# EAGLE design Cameralink_Karmann (EAGLE 7.1.0)
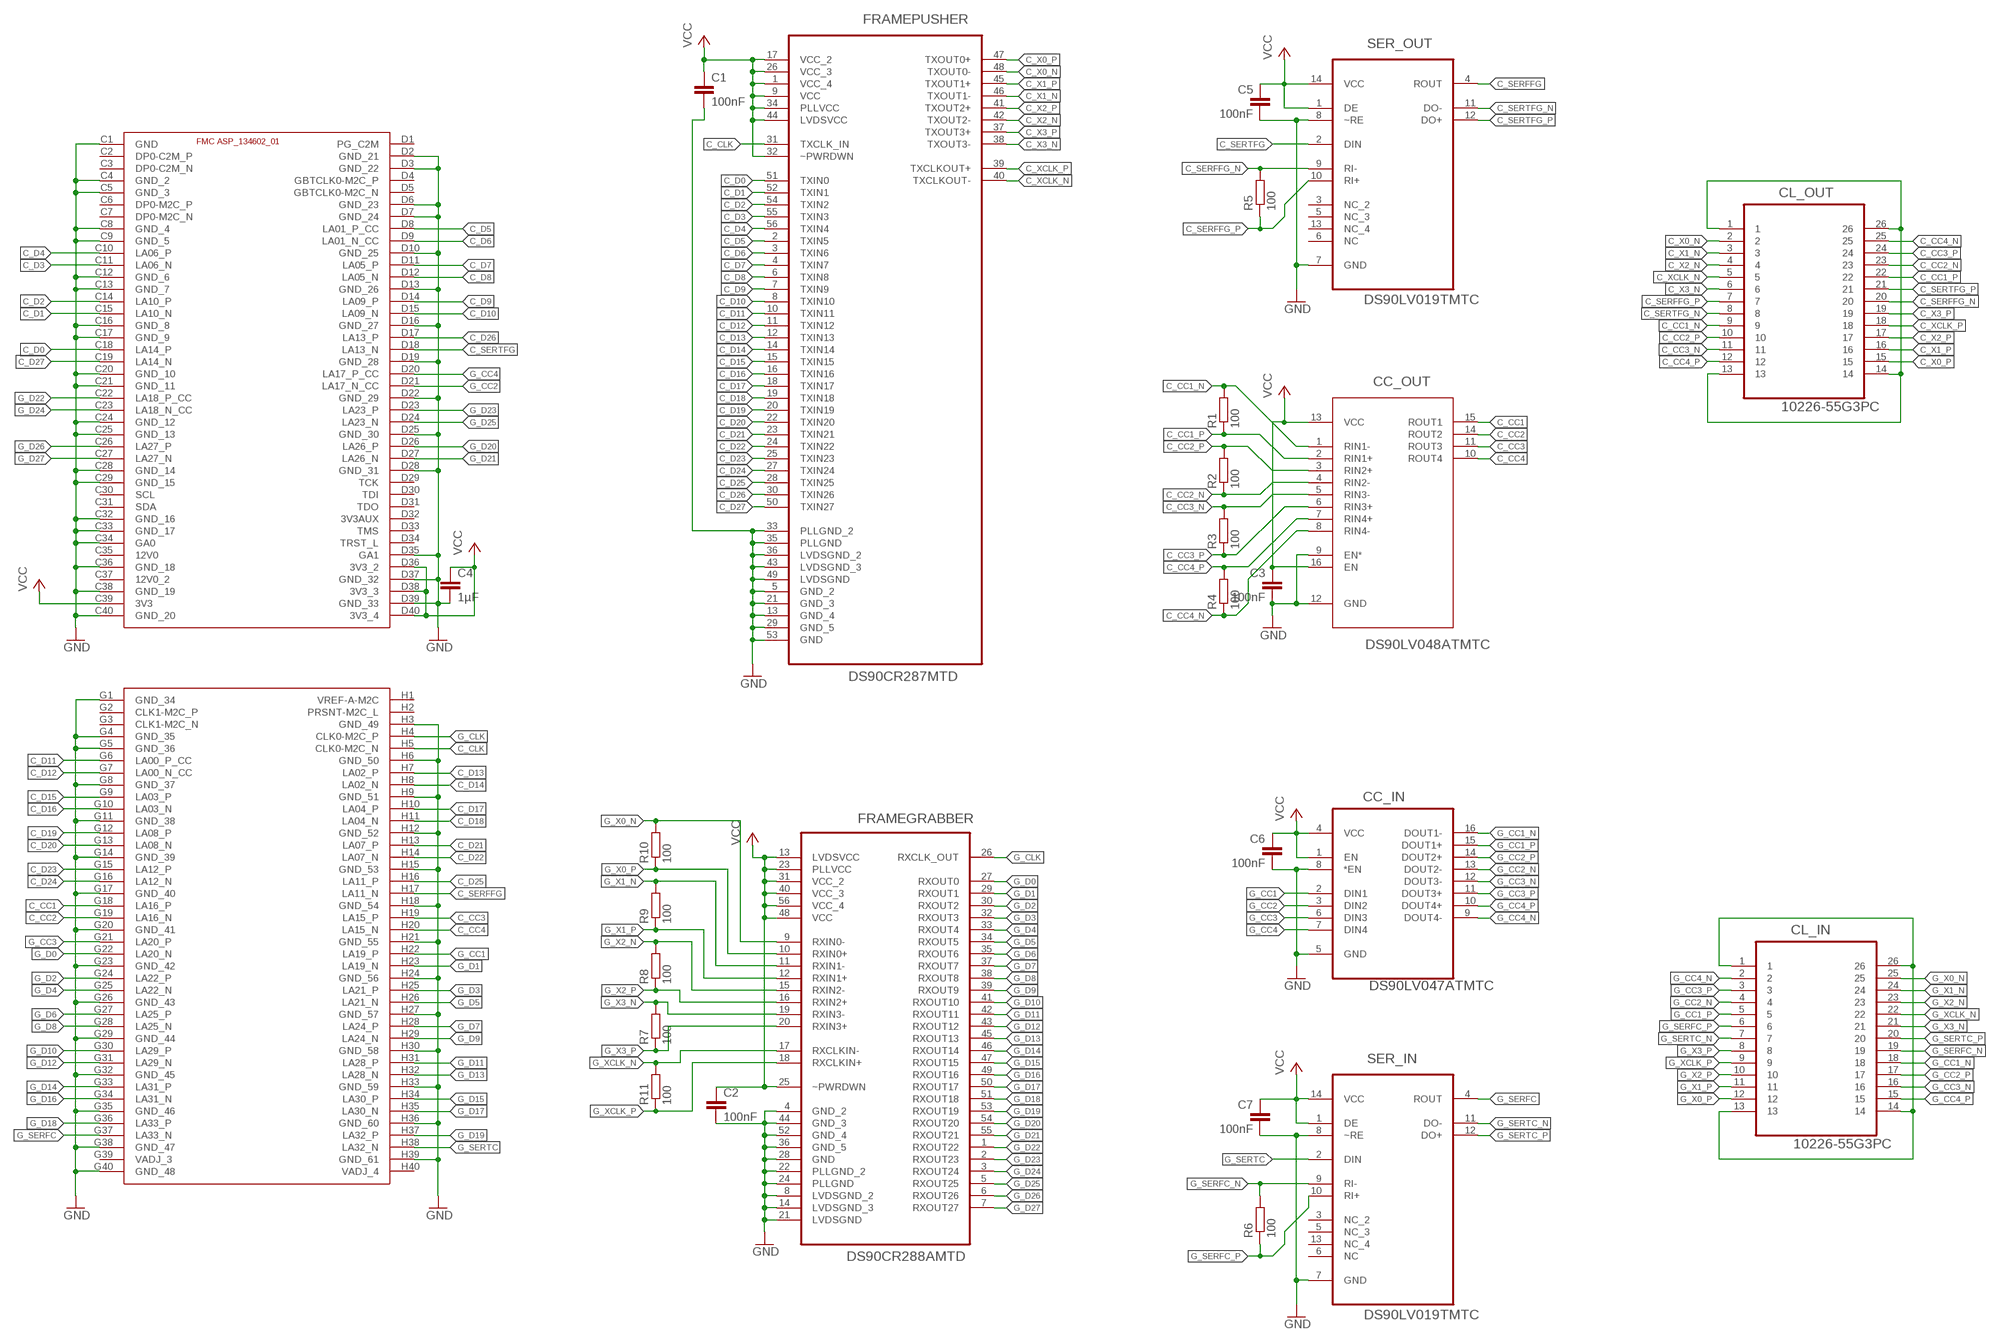
[diagram p0: schematic, sheet 1]

## Parts
C1  100nF  C-EUC1206  [C1206]
C2  100nF  C-EUC1206  [C1206]
C3  100nF  C-EUC1206  [C1206]
C4  1µF  C-EUC1206  [C1206]
C5  100nF  C-EUC1206  [C1206]
C6  100nF  C-EUC1206  [C1206]
C7  100nF  C-EUC1206  [C1206]
CC_IN  DS90LV047ATMTC  [SOP65P640X110-16N]
CC_OUT  DS90LV048ATMTC  [SOP65P640X110-16N]
CL_IN  10226-55G3PC  [3M_10226-55G3PC]
CL_OUT  10226-55G3PC  [3M_10226-55G3PC]
FRAMEGRABBER  DS90CR288AMTD  [SOP50P810X110-56N]
FRAMEPUSHER  DS90CR287MTD  [SOP50P810X110-56N]
R1  100  R-EU_R1206  [R1206]
R2  100  R-EU_R1206  [R1206]
R3  100  R-EU_R1206  [R1206]
R4  100  R-EU_R1206  [R1206]
R5  100  R-EU_R1206  [R1206]
R6  100  R-EU_R1206  [R1206]
R7  100  R-EU_R1206  [R1206]
R8  100  R-EU_R1206  [R1206]
R9  100  R-EU_R1206  [R1206]
R10  100  R-EU_R1206  [R1206]
R11  100  R-EU_R1206  [R1206]
SER_IN  DS90LV019TMTC  [SOP65P640X110-14N]
SER_OUT  DS90LV019TMTC  [SOP65P640X110-14N]
U$1  ASP_134602_01  [ASP_134602_01]

## Nets
C_CC1: CC_OUT.15(ROUT1) U$1.G18(LA16_P)
C_CC1_N: CC_OUT.1(RIN1-) CL_OUT.9 R1.2
C_CC1_P: CC_OUT.2(RIN1+) CL_OUT.22 R1.1
C_CC2: CC_OUT.14(ROUT2) U$1.G19(LA16_N)
C_CC2_N: CC_OUT.4(RIN2-) CL_OUT.23 R2.1
C_CC2_P: CC_OUT.3(RIN2+) CL_OUT.10 R2.2
C_CC3: CC_OUT.11(ROUT3) U$1.H19(LA15_P)
C_CC3_N: CC_OUT.5(RIN3-) CL_OUT.11 R3.2
C_CC3_P: CC_OUT.6(RIN3+) CL_OUT.24 R3.1
C_CC4: CC_OUT.10(ROUT4) U$1.H20(LA15_N)
C_CC4_N: CC_OUT.8(RIN4-) CL_OUT.25 R4.1
C_CC4_P: CC_OUT.7(RIN4+) CL_OUT.12 R4.2
C_CLK: FRAMEPUSHER.31(TXCLK_IN) U$1.H5(CLK0-M2C_N)
C_D0: FRAMEPUSHER.51(TXIN0) U$1.C18(LA14_P)
C_D1: FRAMEPUSHER.52(TXIN1) U$1.C15(LA10_N)
C_D2: FRAMEPUSHER.54(TXIN2) U$1.C14(LA10_P)
C_D3: FRAMEPUSHER.55(TXIN3) U$1.C11(LA06_N)
C_D4: FRAMEPUSHER.56(TXIN4) U$1.C10(LA06_P)
C_D5: FRAMEPUSHER.2(TXIN5) U$1.D8(LA01_P_CC)
C_D6: FRAMEPUSHER.3(TXIN6) U$1.D9(LA01_N_CC)
C_D7: FRAMEPUSHER.4(TXIN7) U$1.D11(LA05_P)
C_D8: FRAMEPUSHER.6(TXIN8) U$1.D12(LA05_N)
C_D9: FRAMEPUSHER.7(TXIN9) U$1.D14(LA09_P)
C_D10: FRAMEPUSHER.8(TXIN10) U$1.D15(LA09_N)
C_D11: FRAMEPUSHER.10(TXIN11) U$1.G6(LA00_P_CC)
C_D12: FRAMEPUSHER.11(TXIN12) U$1.G7(LA00_N_CC)
C_D13: FRAMEPUSHER.12(TXIN13) U$1.H7(LA02_P)
C_D14: FRAMEPUSHER.14(TXIN14) U$1.H8(LA02_N)
C_D15: FRAMEPUSHER.15(TXIN15) U$1.G9(LA03_P)
C_D16: FRAMEPUSHER.16(TXIN16) U$1.G10(LA03_N)
C_D17: FRAMEPUSHER.18(TXIN17) U$1.H10(LA04_P)
C_D18: FRAMEPUSHER.19(TXIN18) U$1.H11(LA04_N)
C_D19: FRAMEPUSHER.20(TXIN19) U$1.G12(LA08_P)
C_D20: FRAMEPUSHER.22(TXIN20) U$1.G13(LA08_N)
C_D21: FRAMEPUSHER.23(TXIN21) U$1.H13(LA07_P)
C_D22: FRAMEPUSHER.24(TXIN22) U$1.H14(LA07_N)
C_D23: FRAMEPUSHER.25(TXIN23) U$1.G15(LA12_P)
C_D24: FRAMEPUSHER.27(TXIN24) U$1.G16(LA12_N)
C_D25: FRAMEPUSHER.28(TXIN25) U$1.H16(LA11_P)
C_D26: FRAMEPUSHER.30(TXIN26) U$1.D17(LA13_P)
C_D27: FRAMEPUSHER.50(TXIN27) U$1.C19(LA14_N)
C_SERFFG: SER_OUT.4(ROUT) U$1.H17(LA11_N)
C_SERFFG_N: CL_OUT.20 R5.2 SER_OUT.9(RI-)
C_SERFFG_P: CL_OUT.7 R5.1 SER_OUT.10(RI+)
C_SERTFG: SER_OUT.2(DIN) U$1.D18(LA13_N)
C_SERTFG_N: CL_OUT.8 SER_OUT.11(DO-)
C_SERTFG_P: CL_OUT.21 SER_OUT.12(DO+)
C_SHIELD: CL_OUT.1 CL_OUT.13 CL_OUT.14 CL_OUT.26
C_X0_N: CL_OUT.2 FRAMEPUSHER.48(TXOUT0-)
C_X0_P: CL_OUT.15 FRAMEPUSHER.47(TXOUT0+)
C_X1_N: CL_OUT.3 FRAMEPUSHER.46(TXOUT1-)
C_X1_P: CL_OUT.16 FRAMEPUSHER.45(TXOUT1+)
C_X2_N: CL_OUT.4 FRAMEPUSHER.42(TXOUT2-)
C_X2_P: CL_OUT.17 FRAMEPUSHER.41(TXOUT2+)
C_X3_N: CL_OUT.6 FRAMEPUSHER.38(TXOUT3-)
C_X3_P: CL_OUT.19 FRAMEPUSHER.37(TXOUT3+)
C_XCLK_N: CL_OUT.5 FRAMEPUSHER.40(TXCLKOUT-)
C_XCLK_P: CL_OUT.18 FRAMEPUSHER.39(TXCLKOUT+)
G_CC1: CC_IN.2(DIN1) U$1.H22(LA19_P)
G_CC1_N: CC_IN.16(DOUT1-) CL_IN.18
G_CC1_P: CC_IN.15(DOUT1+) CL_IN.5
G_CC2: CC_IN.3(DIN2) U$1.D21(LA17_N_CC)
G_CC2_N: CC_IN.13(DOUT2-) CL_IN.4
G_CC2_P: CC_IN.14(DOUT2+) CL_IN.17
G_CC3: CC_IN.6(DIN3) U$1.G21(LA20_P)
G_CC3_N: CC_IN.12(DOUT3-) CL_IN.16
G_CC3_P: CC_IN.11(DOUT3+) CL_IN.3
G_CC4: CC_IN.7(DIN4) U$1.D20(LA17_P_CC)
G_CC4_N: CC_IN.9(DOUT4-) CL_IN.2
G_CC4_P: CC_IN.10(DOUT4+) CL_IN.15
G_CLK: FRAMEGRABBER.26(RXCLK_OUT) U$1.H4(CLK0-M2C_P)
G_D0: FRAMEGRABBER.27(RXOUT0) U$1.G22(LA20_N)
G_D1: FRAMEGRABBER.29(RXOUT1) U$1.H23(LA19_N)
G_D2: FRAMEGRABBER.30(RXOUT2) U$1.G24(LA22_P)
G_D3: FRAMEGRABBER.32(RXOUT3) U$1.H25(LA21_P)
G_D4: FRAMEGRABBER.33(RXOUT4) U$1.G25(LA22_N)
G_D5: FRAMEGRABBER.34(RXOUT5) U$1.H26(LA21_N)
G_D6: FRAMEGRABBER.35(RXOUT6) U$1.G27(LA25_P)
G_D7: FRAMEGRABBER.37(RXOUT7) U$1.H28(LA24_P)
G_D8: FRAMEGRABBER.38(RXOUT8) U$1.G28(LA25_N)
G_D9: FRAMEGRABBER.39(RXOUT9) U$1.H29(LA24_N)
G_D10: FRAMEGRABBER.41(RXOUT10) U$1.G30(LA29_P)
G_D11: FRAMEGRABBER.42(RXOUT11) U$1.H31(LA28_P)
G_D12: FRAMEGRABBER.43(RXOUT12) U$1.G31(LA29_N)
G_D13: FRAMEGRABBER.45(RXOUT13) U$1.H32(LA28_N)
G_D14: FRAMEGRABBER.46(RXOUT14) U$1.G33(LA31_P)
G_D15: FRAMEGRABBER.47(RXOUT15) U$1.H34(LA30_P)
G_D16: FRAMEGRABBER.49(RXOUT16) U$1.G34(LA31_N)
G_D17: FRAMEGRABBER.50(RXOUT17) U$1.H35(LA30_N)
G_D18: FRAMEGRABBER.51(RXOUT18) U$1.G36(LA33_P)
G_D19: FRAMEGRABBER.53(RXOUT19) U$1.H37(LA32_P)
G_D20: FRAMEGRABBER.54(RXOUT20) U$1.D26(LA26_P)
G_D21: FRAMEGRABBER.55(RXOUT21) U$1.D27(LA26_N)
G_D22: FRAMEGRABBER.1(RXOUT22) U$1.C22(LA18_P_CC)
G_D23: FRAMEGRABBER.2(RXOUT23) U$1.D23(LA23_P)
G_D24: FRAMEGRABBER.3(RXOUT24) U$1.C23(LA18_N_CC)
G_D25: FRAMEGRABBER.5(RXOUT25) U$1.D24(LA23_N)
G_D26: FRAMEGRABBER.6(RXOUT26) U$1.C26(LA27_P)
G_D27: FRAMEGRABBER.7(RXOUT27) U$1.C27(LA27_N)
G_SERFC: SER_IN.4(ROUT) U$1.G37(LA33_N)
G_SERFC_N: CL_IN.19 R6.2 SER_IN.9(RI-)
G_SERFC_P: CL_IN.6 R6.1 SER_IN.10(RI+)
G_SERTC: SER_IN.2(DIN) U$1.H38(LA32_N)
G_SERTC_N: CL_IN.7 SER_IN.11(DO-)
G_SERTC_P: CL_IN.20 SER_IN.12(DO+)
G_SHIELD: CL_IN.1 CL_IN.13 CL_IN.14 CL_IN.26
G_X0_N: CL_IN.25 FRAMEGRABBER.9(RXIN0-) R10.2
G_X0_P: CL_IN.12 FRAMEGRABBER.10(RXIN0+) R10.1
G_X1_N: CL_IN.24 FRAMEGRABBER.11(RXIN1-) R9.2
G_X1_P: CL_IN.11 FRAMEGRABBER.12(RXIN1+) R9.1
G_X2_N: CL_IN.23 FRAMEGRABBER.15(RXIN2-) R8.2
G_X2_P: CL_IN.10 FRAMEGRABBER.16(RXIN2+) R8.1
G_X3_N: CL_IN.21 FRAMEGRABBER.19(RXIN3-) R7.2
G_X3_P: CL_IN.8 FRAMEGRABBER.20(RXIN3+) R7.1
G_XCLK_N: CL_IN.22 FRAMEGRABBER.17(RXCLKIN-) R11.2
G_XCLK_P: CL_IN.9 FRAMEGRABBER.18(RXCLKIN+) R11.1
GND: C1.2 C2.2 C3.2 C4.2 C5.2 C6.2 C7.2 CC_IN.5(GND) CC_IN.8(*EN) CC_OUT.9(EN*) CC_OUT.12(GND) FRAMEGRABBER.4(GND_2) FRAMEGRABBER.8(LVDSGND_2) FRAMEGRABBER.14(LVDSGND_3) FRAMEGRABBER.21(LVDSGND) FRAMEGRABBER.22(PLLGND_2) FRAMEGRABBER.24(PLLGND) FRAMEGRABBER.28(GND) FRAMEGRABBER.36(GND_5) FRAMEGRABBER.44(GND_3) FRAMEGRABBER.52(GND_4) FRAMEPUSHER.5(GND_2) FRAMEPUSHER.13(GND_4) FRAMEPUSHER.21(GND_3) FRAMEPUSHER.29(GND_5) FRAMEPUSHER.33(PLLGND_2) FRAMEPUSHER.35(PLLGND) FRAMEPUSHER.36(LVDSGND_2) FRAMEPUSHER.43(LVDSGND_3) FRAMEPUSHER.49(LVDSGND) FRAMEPUSHER.53(GND) SER_IN.7(GND) SER_IN.8(~RE) SER_OUT.7(GND) SER_OUT.8(~RE) U$1.C1(GND) U$1.C4(GND_2) U$1.C5(GND_3) U$1.C8(GND_4) U$1.C9(GND_5) U$1.C12(GND_6) U$1.C13(GND_7) U$1.C16(GND_8) U$1.C17(GND_9) U$1.C20(GND_10) U$1.C21(GND_11) U$1.C24(GND_12) U$1.C25(GND_13) U$1.C28(GND_14) U$1.C29(GND_15) U$1.C32(GND_16) U$1.C33(GND_17) U$1.C34(GA0) U$1.C36(GND_18) U$1.C38(GND_19) U$1.C40(GND_20) U$1.D2(GND_21) U$1.D3(GND_22) U$1.D6(GND_23) U$1.D7(GND_24) U$1.D10(GND_25) U$1.D13(GND_26) U$1.D16(GND_27) U$1.D19(GND_28) U$1.D22(GND_29) U$1.D25(GND_30) U$1.D28(GND_31) U$1.D35(GA1) U$1.D37(GND_32) U$1.D39(GND_33) U$1.G1(GND_34) U$1.G4(GND_35) U$1.G5(GND_36) U$1.G8(GND_37) U$1.G11(GND_38) U$1.G14(GND_39) U$1.G17(GND_40) U$1.G20(GND_41) U$1.G23(GND_42) U$1.G26(GND_43) U$1.G29(GND_44) U$1.G32(GND_45) U$1.G35(GND_46) U$1.G38(GND_47) U$1.G40(GND_48) U$1.H3(GND_49) U$1.H6(GND_50) U$1.H9(GND_51) U$1.H12(GND_52) U$1.H15(GND_53) U$1.H18(GND_54) U$1.H21(GND_55) U$1.H24(GND_56) U$1.H27(GND_57) U$1.H30(GND_58) U$1.H33(GND_59) U$1.H36(GND_60) U$1.H39(GND_61)
VCC: C1.1 C2.1 C3.1 C4.1 C5.1 C6.1 C7.1 CC_IN.1(EN) CC_IN.4(VCC) CC_OUT.13(VCC) CC_OUT.16(EN) FRAMEGRABBER.13(LVDSVCC) FRAMEGRABBER.23(PLLVCC) FRAMEGRABBER.25(~PWRDWN) FRAMEGRABBER.31(VCC_2) FRAMEGRABBER.40(VCC_3) FRAMEGRABBER.48(VCC) FRAMEGRABBER.56(VCC_4) FRAMEPUSHER.1(VCC_4) FRAMEPUSHER.9(VCC) FRAMEPUSHER.17(VCC_2) FRAMEPUSHER.26(VCC_3) FRAMEPUSHER.32(~PWRDWN) FRAMEPUSHER.34(PLLVCC) FRAMEPUSHER.44(LVDSVCC) SER_IN.1(DE) SER_IN.14(VCC) SER_OUT.1(DE) SER_OUT.14(VCC) U$1.C39(3V3) U$1.D36(3V3_2) U$1.D38(3V3_3) U$1.D40(3V3_4)
Unconnected: SER_IN.3(NC_2) SER_IN.5(NC_3) SER_IN.6(NC) SER_IN.13(NC_4) SER_OUT.3(NC_2) SER_OUT.5(NC_3) SER_OUT.6(NC) SER_OUT.13(NC_4) U$1.C2(DP0-C2M_P) U$1.C3(DP0-C2M_N) U$1.C6(DP0-M2C_P) U$1.C7(DP0-M2C_N) U$1.C30(SCL) U$1.C31(SDA) U$1.C35(12V0) U$1.C37(12V0_2) U$1.D1(PG_C2M) U$1.D4(GBTCLK0-M2C_P) U$1.D5(GBTCLK0-M2C_N) U$1.D29(TCK) U$1.D30(TDI) U$1.D31(TDO) U$1.D32(3V3AUX) U$1.D33(TMS) U$1.D34(TRST_L) U$1.G2(CLK1-M2C_P) U$1.G3(CLK1-M2C_N) U$1.G39(VADJ_3) U$1.H1(VREF-A-M2C) U$1.H2(PRSNT-M2C_L) U$1.H40(VADJ_4)

## Library data of the parts
C1-C7 = rcl:C-EU: CAPACITOR, European symbol
CC_IN = Cameralink:DS90LV047ATMTC: CMOS Differential Line Driver; MPN: DS90LV047ATMTC; OC_FARNELL: 9778659; OC_NEWARK: 41K2094; PACKAGE: 16-TSSOP; SUPPLIER: National Semiconductor
CC_OUT = Cameralink:DS90LV048ATMTC: LVDS Quad CMOS Differential Line Receiver; MPN: DS90LV048ATMTC; OC_FARNELL: 9778667; OC_NEWARK: 74C3618; PACKAGE: TSSOP-16; SUPPLIER: National Semiconductor
CL_IN CL_OUT = Cameralink:10226-55G3PC: CONN MDR RCPT 26POS R/A M2.5; MPN: 10226-55G3PC; OC_FARNELL: 1463015; OC_NEWARK: 93K6331; PACKAGE: MDR RCPT 26POS R/A M2.; SUPPLIER: 3M
FRAMEGRABBER = Cameralink:DS90CR288AMTD: Edge Data Strobe; MPN: DS90CR288AMTD; OC_FARNELL: 1685539; OC_NEWARK: 41K2011; PACKAGE: SOP-56; SUPPLIER: NationalSemiconductor
FRAMEPUSHER = Cameralink:DS90CR287MTD: Edge Data Strobe; MPN: DS90CR287MTD; OC_FARNELL: 1215184; OC_NEWARK: 01M7382; PACKAGE: SSOP-56; SUPPLIER: NationalSemiconductor
R1-R11 = rcl:R-EU_: RESISTOR, European symbol
SER_IN SER_OUT = Cameralink:DS90LV019TMTC: LVDS Driver/Receiver; MPN: DS90LV019TMTC; OC_FARNELL: 1286826; OC_NEWARK: 38K1016; PACKAGE: SOP-14; SUPPLIER: NationalSemiconductor
U$1 = FMC_Stecker:ASP_134602_01

## Board
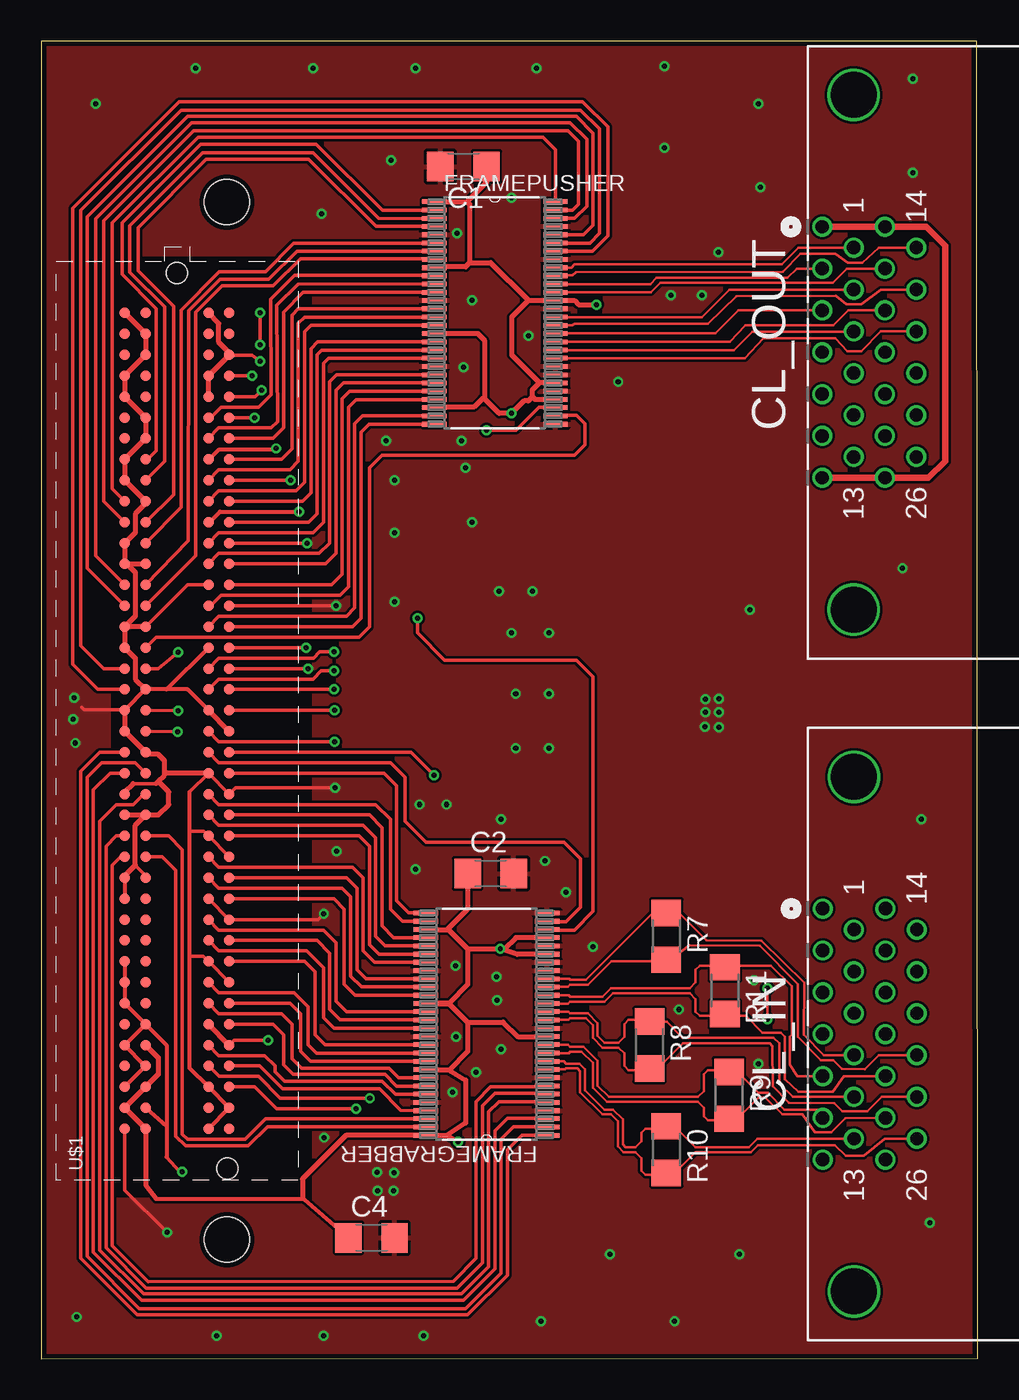
[diagram p1: board, top side]
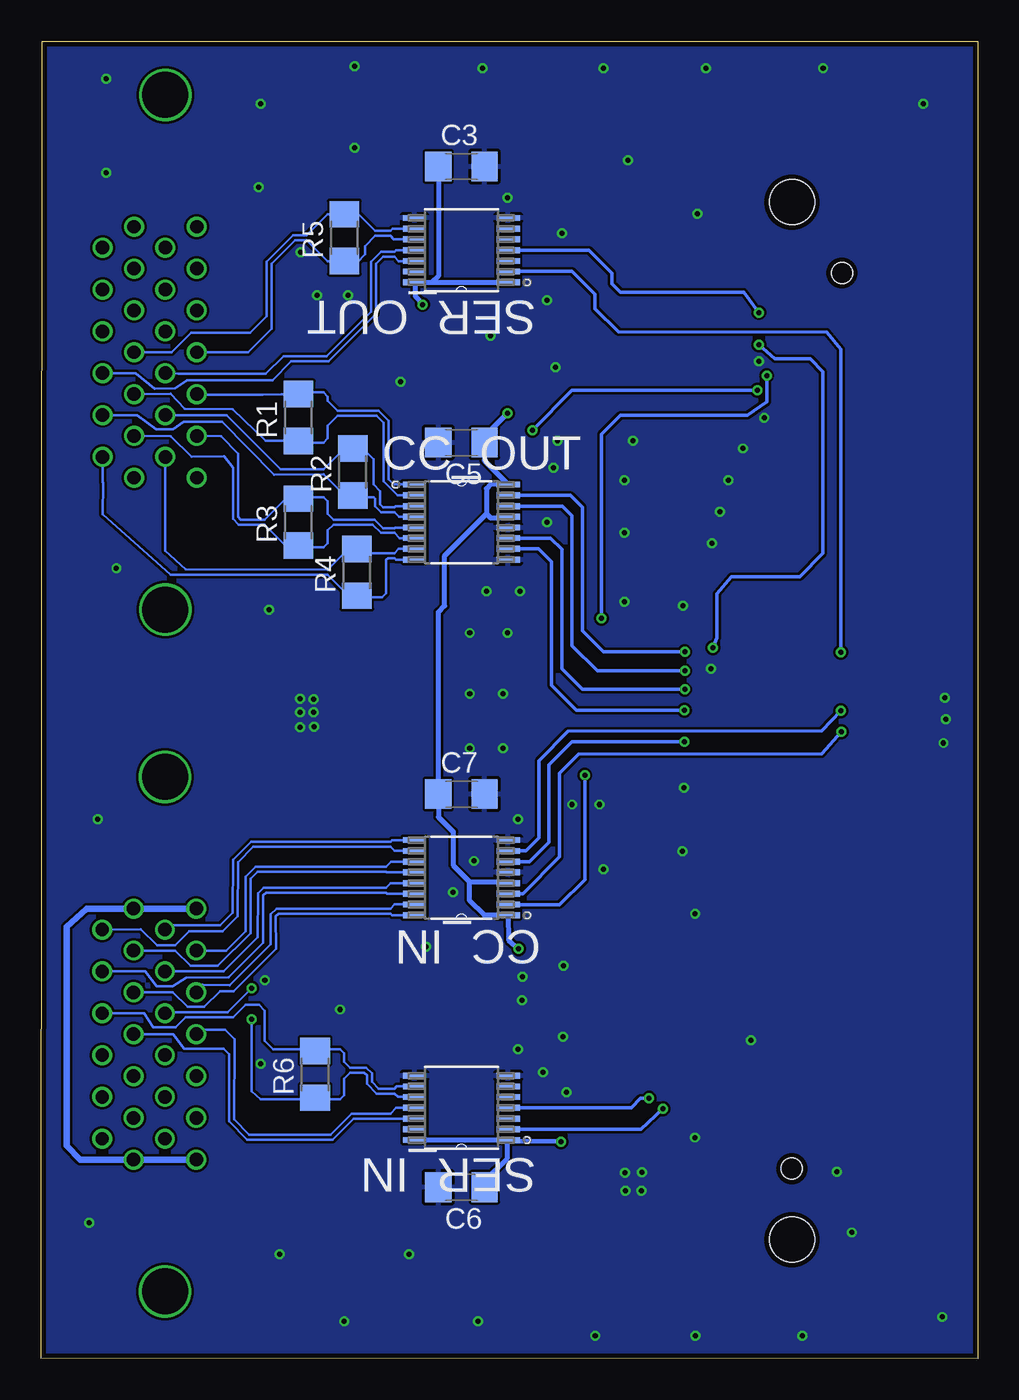
[diagram p2: board, bottom side, seen from below]

Size 56.9 x 80 mm. Coordinates in mm from the lower left corner, seen from the top.
Outline: 0,0 56.9,0.03 56.82,80 0,80 0,0
Copper layers (1*16): Top 0.035mm / dielectric 1.5mm / Bottom 0.035mm
Design rules "PCB-POOL_Standard[1]": minimum track width 0.15mm, minimum drill 0.3mm, track to track 0.15mm, track to pad 0.15mm, pad to pad 0.15mm, via to via 0.15mm, smd to smd 0.15mm, copper to edge 0.3mm, drill to drill 0.2mm, minimum pad ring 0.2mm, minimum via ring 0.15mm, stop-mask expansion 0.075mm, vias tented up to drill 0mil, thermal gap 0.2mm
tRestrict: area 4.3,9.8 to 16.4,66.9

### Footprints (pad centres in the part's own frame; a part is rotated, then mirrored left to right if it is on the bottom)
C1206 = smd 1.6 x 1.8: 1 -1.4,0; 2 1.4,0
SOP65P640X110-16N = smd 1.422 x 0.356: 1 -2.845,2.286; 2 -2.845,1.626; 3 -2.845,0.965; 4 -2.845,0.33; 5 -2.845,-0.33; 6 -2.845,-0.965; 7 -2.845,-1.626; 8 -2.845,-2.286; 9 2.845,-2.286; 10 2.845,-1.626; 11 2.845,-0.965; 12 2.845,-0.33; 13 2.845,0.33; 14 2.845,0.965; 15 2.845,1.626; 16 2.845,2.286
3M_10226-55G3PC = drill 0.813: 1 15.24,5.715; 2 13.97,3.81; 3 12.7,5.715; 4 11.43,3.81; 5 10.16,5.715; 6 8.89,3.81; 7 7.62,5.715; 8 6.35,3.81; 9 5.08,5.715; 10 3.81,3.81; 11 2.54,5.715; 12 1.27,3.81; 13 0,5.715; 14 15.24,1.905; 15 13.97,0; 16 12.7,1.905; 17 11.43,0; 18 10.16,1.905; 19 8.89,0; 20 7.62,1.905; 21 6.35,0; 22 5.08,1.905; 23 3.81,0; 24 2.54,1.905; 25 1.27,0; 26 0,1.905 | drill 2.794: 27 -8.001,3.81; 28 23.241,3.81
SOP50P810X110-56N = smd 1.473 x 0.279: 1 -3.683,6.756; 2 -3.683,6.248; 3 -3.683,5.74; 4 -3.683,5.258; 5 -3.683,4.75; 6 -3.683,4.242; 7 -3.683,3.759; 8 -3.683,3.251; 9 -3.683,2.743; 10 -3.683,2.261; 11 -3.683,1.753; 12 -3.683,1.245; 13 -3.683,0.762; 14 -3.683,0.254; 15 -3.683,-0.254; 16 -3.683,-0.762; 17 -3.683,-1.245; 18 -3.683,-1.753; 19 -3.683,-2.261; 20 -3.683,-2.743; 21 -3.683,-3.251; 22 -3.683,-3.759; 23 -3.683,-4.242; 24 -3.683,-4.75; 25 -3.683,-5.258; 26 -3.683,-5.74; 27 -3.683,-6.248; 28 -3.683,-6.756; 29 3.683,-6.756; 30 3.683,-6.248; 31 3.683,-5.74; 32 3.683,-5.258; 33 3.683,-4.75; 34 3.683,-4.242; 35 3.683,-3.759; 36 3.683,-3.251; 37 3.683,-2.743; 38 3.683,-2.261; 39 3.683,-1.753; 40 3.683,-1.245; 41 3.683,-0.762; 42 3.683,-0.254; 43 3.683,0.254; 44 3.683,0.762; 45 3.683,1.245; 46 3.683,1.753; 47 3.683,2.261; 48 3.683,2.743; 49 3.683,3.251; 50 3.683,3.759; 51 3.683,4.242; 52 3.683,4.75; 53 3.683,5.258; 54 3.683,5.74; 55 3.683,6.248; 56 3.683,6.756
R1206 = smd 1.6 x 1.803: 1 -1.422,0; 2 1.422,0
SOP65P640X110-14N = smd 1.422 x 0.356: 1 -2.845,1.956; 2 -2.845,1.295; 3 -2.845,0.66; 4 -2.845,0; 5 -2.845,-0.66; 6 -2.845,-1.295; 7 -2.845,-1.956; 8 2.845,-1.956; 9 2.845,-1.295; 10 2.845,-0.66; 11 2.845,0; 12 2.845,0.66; 13 2.845,1.295; 14 2.845,1.956
ASP_134602_01 = smd 0.635 x 0.635: C1 49.53,-2.54; C2 48.26,-2.54; C3 46.99,-2.54; C4 45.72,-2.54; C5 44.45,-2.54; C6 43.18,-2.54; C7 41.91,-2.54; C8 40.64,-2.54; C9 39.37,-2.54; C10 38.1,-2.54; C11 36.83,-2.54; C12 35.56,-2.54; C13 34.29,-2.54; C14 33.02,-2.54; C15 31.75,-2.54; C16 30.48,-2.54; C17 29.21,-2.54; C18 27.94,-2.54; C19 26.67,-2.54; C20 25.4,-2.54; C21 24.13,-2.54; C22 22.86,-2.54; C23 21.59,-2.54; C24 20.32,-2.54; C25 19.05,-2.54; C26 17.78,-2.54; C27 16.51,-2.54; C28 15.24,-2.54; C29 13.97,-2.54; C30 12.7,-2.54; C31 11.43,-2.54; C32 10.16,-2.54; C33 8.89,-2.54; C34 7.62,-2.54; C35 6.35,-2.54; C36 5.08,-2.54; C37 3.81,-2.54; C38 2.54,-2.54; C39 1.27,-2.54; C40 0,-2.54; D1 49.53,-3.81; D2 48.26,-3.81; D3 46.99,-3.81; D4 45.72,-3.81; D5 44.45,-3.81; D6 43.18,-3.81; D7 41.91,-3.81; D8 40.64,-3.81; D9 39.37,-3.81; D10 38.1,-3.81; D11 36.83,-3.81; D12 35.56,-3.81; D13 34.29,-3.81; D14 33.02,-3.81; D15 31.75,-3.81; D16 30.48,-3.81; D17 29.21,-3.81; D18 27.94,-3.81; D19 26.67,-3.81; D20 25.4,-3.81; D21 24.13,-3.81; D22 22.86,-3.81; D23 21.59,-3.81; D24 20.32,-3.81; D25 19.05,-3.81; D26 17.78,-3.81; D27 16.51,-3.81; D28 15.24,-3.81; D29 13.97,-3.81; D30 12.7,-3.81; D31 11.43,-3.81; D32 10.16,-3.81; D33 8.89,-3.81; D34 7.62,-3.81; D35 6.35,-3.81; D36 5.08,-3.81; D37 3.81,-3.81; D38 2.54,-3.81; D39 1.27,-3.81; D40 0,-3.81; G1 49.53,-7.62; G2 48.26,-7.62; G3 46.99,-7.62; G4 45.72,-7.62; G5 44.45,-7.62; G6 43.18,-7.62; G7 41.91,-7.62; G8 40.64,-7.62; G9 39.37,-7.62; G10 38.1,-7.62; G11 36.83,-7.62; G12 35.56,-7.62; G13 34.29,-7.62; G14 33.02,-7.62; G15 31.75,-7.62; G16 30.48,-7.62; G17 29.21,-7.62; G18 27.94,-7.62; G19 26.67,-7.62; G20 25.4,-7.62; G21 24.13,-7.62; G22 22.86,-7.62; G23 21.59,-7.62; G24 20.32,-7.62; G25 19.05,-7.62; G26 17.78,-7.62; G27 16.51,-7.62; G28 15.24,-7.62; G29 13.97,-7.62; G30 12.7,-7.62; G31 11.43,-7.62; G32 10.16,-7.62; G33 8.89,-7.62; G34 7.62,-7.62; G35 6.35,-7.62; G36 5.08,-7.62; G37 3.81,-7.62; G38 2.54,-7.62; G39 1.27,-7.62; G40 0,-7.62; H1 49.53,-8.89; H2 48.26,-8.89; H3 46.99,-8.89; H4 45.72,-8.89; H5 44.45,-8.89; H6 43.18,-8.89; H7 41.91,-8.89; H8 40.64,-8.89; H9 39.37,-8.89; H10 38.1,-8.89; H11 36.83,-8.89; H12 35.56,-8.89; H13 34.29,-8.89; H14 33.02,-8.89; H15 31.75,-8.89; H16 30.48,-8.89; H17 29.21,-8.89; H18 27.94,-8.89; H19 26.67,-8.89; H20 25.4,-8.89; H21 24.13,-8.89; H22 22.86,-8.89; H23 21.59,-8.89; H24 20.32,-8.89; H25 19.05,-8.89; H26 17.78,-8.89; H27 16.51,-8.89; H28 15.24,-8.89; H29 13.97,-8.89; H30 12.7,-8.89; H31 11.43,-8.89; H32 10.16,-8.89; H33 8.89,-8.89; H34 7.62,-8.89; H35 6.35,-8.89; H36 5.08,-8.89; H37 3.81,-8.89; H38 2.54,-8.89; H39 1.27,-8.89; H40 0,-8.89 | hole 1.27: -2.426,-8.763; 51.956,-5.715 | hole 2.731: -6.731,-8.745; 56.261,-8.745

### Placement (x,y rotation side)
C1  25.65,72.39 180 top
C2  27.3,29.46 0 top
C3  31.37,72.39 0 bottom
C4  20.07,7.34 0 top
C5  31.37,55.63 180 bottom
C6  31.37,10.41 180 bottom
C7  31.37,34.29 0 bottom
CC_IN  31.37,29.21 180 bottom
CC_OUT  31.37,50.8 0 bottom
CL_IN  53.19,12.09 90 top
CL_OUT  53.16,53.49 90 top
FRAMEGRABBER  27.05,20.32 180 top
FRAMEPUSHER  27.56,63.5 0 top
R1  41.27,57.15 90 bottom
R2  37.97,53.85 90 bottom
R3  41.27,50.8 90 bottom
R4  37.72,47.75 90 bottom
R5  38.48,68.07 90 bottom
R6  40.26,17.27 90 bottom
R7  37.97,25.65 270 top
R8  36.96,19.05 270 top
R9  41.78,16 270 top
R10  37.97,12.7 270 top
R11  41.53,22.35 270 top
SER_IN  31.37,15.24 180 bottom
SER_OUT  31.37,67.31 180 bottom
U$1  2.54,13.97 90 top

### Tracks (layer width: path | path; a pad name or v marks a point on that pad's centre or on a via)
C_CC1  (via drill 0.3)
  Top 0.203: U$1.G18 10.79,42.55 16.54,42.55 16.92,42.93 v17.8,42.93
  Bottom 0.203: CC_OUT.15 24.74,52.43 24,51.69 24,44.2 22.73,42.93 v17.8,42.93
C_CC1_N
  Bottom 0.15: CC_OUT.1 35.48,53.09 35.79,53.4 35.79,56.96 36.39,57.55 38.88,57.55 39.5,58.17 39.5,58.42 39.75,58.67 41.17,58.67 R1.2 42.29,58.57 43.43,58.55 46.97,58.55 CL_OUT.9
C_CC1_P
  Bottom 0.15: CC_OUT.2 35.24,52.43 36.09,53.28 36.09,56.83 36.51,57.25 38.88,57.25 39.5,56.64 39.5,55.88 39.75,55.63 41.17,55.63 R1.1 43.26,55.73 45.26,57.66 48.18,57.68 49.02,58.6 CL_OUT.22
C_CC2  (via drill 0.3)
  Top 0.203: U$1.G19 10.79,41.27 16.51,41.27 17.02,41.78 v17.8,41.78
  Bottom 0.203: CC_OUT.14 25.22,51.77 24.64,51.18 24.64,43.31 23.11,41.78 v17.8,41.78
C_CC2_N
  Bottom 0.15: CC_OUT.4 35.15,51.13 35.43,51.41 36.26,51.41 36.6,51.75 36.6,52.22 36.7,52.32 37.87,52.32 R2.1 38.48,52.43 39.75,53.7 42.73,53.67 45.91,56.9 48.23,56.9 48.87,56.44 49.91,56.44 51.05,57.28 CL_OUT.23
C_CC2_P
  Bottom 0.15: CC_OUT.3 35.38,51.77 35.43,51.71 36.13,51.71 36.3,51.88 36.3,52.68 36.7,53.09 36.7,54.61 37.21,55.12 37.82,55.12 R2.2 38.48,55.27 39.75,54 42.36,54 45.63,57.3 48.89,57.3 CL_OUT.10
C_CC3  (via drill 0.3)
  Top 0.203: v17.8,40.64 U$1.H19
  Bottom 0.203: CC_OUT.11 25.96,49.84 25.27,49.15 25.27,41.91 24,40.64 v17.8,40.64
C_CC3_N
  Bottom 0.15: CC_OUT.5 35.41,50.47 35.43,50.44 36.13,50.44 36.64,50.95 39.14,50.95 39.5,51.31 39.5,52.07 39.75,52.32 41.17,52.32 R3.2 42.03,52.22 43.31,50.95 44.77,50.95 44.94,51.12 44.94,54.95 45.97,56.01 CL_OUT.11
C_CC3_P
  Bottom 0.15: CC_OUT.6 35.13,49.84 35.43,50.14 36.26,50.14 36.77,50.65 39.14,50.65 39.5,50.29 39.5,49.53 39.75,49.28 41.17,49.28 R3.1 42.03,49.38 43.31,50.65 44.89,50.65 45.23,50.99 45.23,54.12 45.78,54.79 47.75,54.77 49.02,56.01 CL_OUT.24
C_CC4  (via drill 0.3)
  Top 0.203: v17.83,39.37 U$1.H20
  Bottom 0.203: CC_OUT.10 26.7,49.17 25.91,48.39 25.91,40.89 24.38,39.37 v17.83,39.37
C_CC4_N
  Bottom 0.15: CC_OUT.8 35.33,48.51 35.43,48.62 35.84,48.62 35.94,48.51 35.94,46.48 36.2,46.23 37.62,46.23 R4.1 38.23,46.33 39.5,47.6 49.02,47.6 53.16,51.28 53.14,53.16 53.16,53.24 CL_OUT.25
C_CC4_P
  Bottom 0.15: CC_OUT.7 35.18,49.17 35.43,48.92 37.46,48.92 R4.2 38.23,49.17 39.5,47.9 48.1,47.93 49.35,49.07 CL_OUT.12
C_CLK  (via drill 0.3)
  Top 0.203: v27.05,56.39 28.83,56.39 30.23,57.78 31.22,57.78 FRAMEPUSHER.31 | v13.39,58.8 13.01,58.42 U$1.H5
  Bottom 0.203: v27.05,56.39 24.64,58.8 v13.39,58.8
C_D0
  Top 0.203: FRAMEPUSHER.51 33.33,67.74 33.91,68.33 33.91,74.68 32.77,75.82 8.51,75.82 2.41,69.72 2.41,43.31 3.81,41.91 U$1.C18
C_D1
  Top 0.203: FRAMEPUSHER.52 32.94,68.25 33.53,68.83 33.53,74.42 32.51,75.44 8.89,75.44 2.79,69.34 2.79,48.01 U$1.C15
C_D2
  Top 0.203: FRAMEPUSHER.54 32.41,69.24 33.15,69.98 33.15,74.04 32.13,75.06 9.14,75.06 3.3,69.22 3.3,48.77 U$1.C14
C_D3
  Top 0.203: FRAMEPUSHER.55 32.28,69.75 32.64,70.1 32.64,73.91 32,74.55 9.27,74.55 3.81,69.09 3.81,52.07 U$1.C11
C_D4
  Top 0.203: U$1.C10 4.32,52.83 4.32,68.96 9.53,74.17 30.48,74.17 31.24,73.41 FRAMEPUSHER.56
C_D5
  Top 0.203: U$1.D8 6.48,54.61 6.99,55.12 6.99,63.75 4.93,65.84 4.93,68.96 9.7,73.74 16.71,73.74 20.73,69.72 23.85,69.72 FRAMEPUSHER.2
C_D6
  Top 0.203: U$1.D9 7.49,54.48 7.49,63.88 5.38,65.96 5.38,68.81 9.8,73.23 16.51,73.23 20.5,69.24 23.85,69.22 FRAMEPUSHER.3
C_D7
  Top 0.203: U$1.D11 8.05,52.48 8.05,63.91 5.89,66.06 5.89,68.68 10.03,72.82 16.26,72.82 20.34,68.76 FRAMEPUSHER.4 23.82,68.71
C_D8
  Top 0.203: U$1.D12 8.51,51.69 8.51,63.68 10.82,65.99 13.64,65.99 15.34,67.74 FRAMEPUSHER.6
C_D9
  Top 0.203: U$1.D14 8.94,49.66 8.97,63.63 10.87,65.53 13.82,65.53 15.54,67.26 FRAMEPUSHER.7
C_D10
  Top 0.203: U$1.D15 9.4,48.77 9.4,63.55 11,65.15 14.1,65.15 15.75,66.8 23.82,66.8 FRAMEPUSHER.8
C_D11
  Top 0.203: U$1.G6 10.29,57.15 10.92,57.78 13.21,57.78 13.97,58.55 13.95,64.34 15.39,65.79 23.85,65.79 FRAMEPUSHER.10
C_D12
  Top 0.203: U$1.G7 10.79,56.52 13.97,56.52 14.35,56.9 14.3,63.96 15.6,65.23 23.85,65.28 FRAMEPUSHER.11
C_D13
  Top 0.203: U$1.H7 14.1,55.88 14.73,56.52 14.73,63.55 15.93,64.77 FRAMEPUSHER.12
C_D14
  Top 0.203: U$1.H8 14.61,54.61 15.24,55.24 15.24,63.37 15.62,63.75 FRAMEPUSHER.14
C_D15
  Top 0.203: U$1.G9 10.79,53.98 15.11,53.98 15.62,54.48 15.62,62.87 16,63.25 FRAMEPUSHER.15
C_D16
  Top 0.203: U$1.G10 10.79,52.7 15.49,52.7 16,53.21 16,62.36 16.38,62.74 FRAMEPUSHER.16
C_D17
  Top 0.203: U$1.H10 15.88,52.07 16.38,52.58 16.38,61.34 16.79,61.75 FRAMEPUSHER.18
C_D18
  Top 0.203: U$1.H11 16.26,50.8 16.76,51.31 16.76,60.96 17.04,61.24 FRAMEPUSHER.19
C_D19
  Top 0.203: U$1.G12 10.79,50.16 16.51,50.16 17.14,50.8 17.14,60.45 17.45,60.76 FRAMEPUSHER.20
C_D20
  Top 0.203: U$1.G13 10.79,48.9 16.89,48.9 17.53,49.53 17.53,59.31 17.96,59.74 FRAMEPUSHER.22
C_D21
  Top 0.203: U$1.H13 17.27,48.26 17.91,48.9 17.91,58.8 18.36,59.26 FRAMEPUSHER.23
C_D22
  Top 0.203: U$1.H14 17.65,46.99 18.29,47.62 18.29,58.29 18.75,58.75 FRAMEPUSHER.24
C_D23
  Top 0.203: U$1.G15 10.29,45.72 10.92,46.35 18.16,46.35 18.67,46.86 18.67,57.78 19.13,58.24 FRAMEPUSHER.25
C_D24
  Top 0.203: U$1.G16 10.79,45.09 18.54,45.09 19.05,45.59 19.05,56.77 19.53,57.25 FRAMEPUSHER.27
C_D25
  Top 0.203: U$1.H16 18.92,44.45 19.43,44.96 19.43,56.26 19.91,56.74 FRAMEPUSHER.28
C_D26
  Top 0.203: U$1.D17 6.99,43.81 19.3,43.81 19.94,44.45 19.94,54.1 20.7,54.86 32.38,54.86 33.02,55.5 33.02,56.77 32.51,57.28 31.27,57.28 FRAMEPUSHER.30
C_D27
  Top 0.203: FRAMEPUSHER.50 33.48,67.26 34.42,68.2 34.42,74.8 32.96,76.26 32.89,76.33 8.38,76.33 1.91,69.85 1.91,42.16 3.43,40.64 U$1.C19
C_SERFFG  (via drill 0.3)
  Top 0.203: v13.31,63.52 v13.31,61.57 | v16.1,43.18 U$1.H17
  Bottom 0.203: SER_OUT.4 23.62,67.31 22.23,65.91 22.23,65.28 21.72,64.77 14.2,64.77 v13.31,63.52 | v13.31,61.57 12.32,60.71 10.16,60.71 9.4,59.94 9.4,48.9 10.79,47.5 14.96,47.5 15.85,46.46 15.85,43.79 v16.1,43.18
C_SERFFG_N
  Bottom 0.15: SER_OUT.9 35.56,68.61 35.69,68.48 36.6,68.48 37.72,69.6 38.38,69.6 R5.2 39.49,69.49 40.77,68.22 41.59,68.22 43.2,66.61 43.2,63.3 44.2,62.31 47.78,62.31 48.97,61.11 CL_OUT.20
C_SERFFG_P
  Bottom 0.15: SER_OUT.10 35.48,67.97 35.69,68.18 36.6,68.18 37.21,67.56 37.21,67.06 37.72,66.55 38.38,66.55 R5.1 39.49,66.65 40.77,67.92 41.47,67.92 42.9,66.49 42.9,62.53 44.32,61.11 CL_OUT.7
C_SERTFG  (via drill 0.3)
  Top 0.203: U$1.D18 7.11,41.91 v8.33,42.9
  Bottom 0.203: v8.33,42.9 8.33,61.29 9.17,62.33 21.84,62.36 23.24,63.75 23.24,64.64 24.64,66.04 28.5,66.04 SER_OUT.2
C_SERTFG_N
  Bottom 0.15: SER_OUT.11 35.33,67.31 35.43,67.21 36.26,67.21 36.85,66.61 36.85,63.56 39.56,60.88 42.17,60.88 43.27,59.81 48.54,59.81 CL_OUT.8
C_SERTFG_P
  Bottom 0.15: SER_OUT.12 35.18,66.65 35.43,66.91 36.13,66.91 36.55,66.49 36.55,63.44 39.44,60.56 41.72,60.56 42.84,59.41 48.03,59.41 48.74,58.93 49.99,58.9 51.16,59.84 CL_OUT.21
C_SHIELD
  Top 0.406: CL_OUT.1 CL_OUT.14 53.77,68.73 54.91,67.59 54.91,54.48 53.9,53.49 CL_OUT.26 CL_OUT.13
C_X0_N
  Top 0.15: CL_OUT.2 46,67.46 44.99,66.45 32.41,66.45 32.21,66.24 FRAMEPUSHER.48
C_X0_P
  Top 0.15: 31.27,65.79 32.28,65.79 32.49,65.97 45.06,65.99 46.13,67.08 48.23,67.08 49,66.55 49.89,66.55 50.88,67.46 CL_OUT.15
  Top 0.254: 31.27,65.79 FRAMEPUSHER.47
C_X1_N
  Top 0.15: FRAMEPUSHER.46 37.01,65.25 37.39,65.63 45.34,65.63 45.9,66.19 CL_OUT.3
C_X1_P
  Top 0.15: FRAMEPUSHER.45 37.03,64.75 37.62,65.33 48.08,65.33 48.95,66.19 CL_OUT.16
C_X2_N
  Top 0.15: FRAMEPUSHER.42 40.13,63.25 41.81,64.92 CL_OUT.4
C_X2_P
  Top 0.15: FRAMEPUSHER.41 32.28,62.74 32.38,62.84 40.52,62.84 42.24,64.52 48.26,64.54 48.92,64.03 49.84,64.03 51,64.92 CL_OUT.17
C_X3_N
  Top 0.15: FRAMEPUSHER.38 42.09,61.24 43.2,62.36 49.33,62.36 CL_OUT.6
C_X3_P
  Top 0.15: FRAMEPUSHER.37 42.75,60.76 43.87,61.98 48.23,61.98 48.97,61.19 49.81,61.19 51,62.38 CL_OUT.19
C_XCLK_N
  Top 0.15: FRAMEPUSHER.40 40.97,62.26 42.37,63.65 CL_OUT.5
C_XCLK_P
  Top 0.15: FRAMEPUSHER.39 41.83,61.75 42.77,62.74 48.13,62.74 49.02,63.65 CL_OUT.18
G_CC1  (via drill 0.3)
  Top 0.203: U$1.H22 22.48,36.83 v23.88,35.43
  Bottom 0.203: v23.88,35.43 23.88,29.08 25.4,27.56 28.5,27.56 CC_IN.2
G_CC1_N
  Bottom 0.15: CC_IN.16 35.58,26.92 35.69,27.03 42.48,27.03 42.65,26.86 42.62,24.91 45.21,22.32 46.03,22.32 46.99,21.36 48.01,21.36 48.9,22.25 CL_IN.18 51.31,22.25
G_CC1_P
  Bottom 0.15: CC_IN.15 35.43,27.58 35.69,27.33 42.61,27.33 42.95,26.99 42.95,25.18 45.45,22.69 47.09,22.71 CL_IN.5
G_CC2  (via drill 0.3)
  Top 0.203: v8.28,38.08 U$1.D21
  Bottom 0.203: CC_IN.3 27.64,28.25 25.4,30.48 25.4,35.56 24.26,36.7 9.47,36.73 v8.28,38.08
G_CC2_N
  Bottom 0.15: CC_IN.13 35.66,28.88 35.94,28.6 43.37,28.6 43.71,28.26 43.74,25.59 45.8,23.52 CL_IN.4
G_CC2_P
  Bottom 0.15: CC_IN.14 35.89,28.25 35.94,28.3 43.24,28.3 43.41,28.13 43.41,25.26 45.51,23.17 48.08,23.14 48.9,22.63 49.89,22.63 50.57,23.52 CL_IN.17
G_CC3  (via drill 0.3)
  Top 0.203: v17.83,37.47 10.79,37.47 U$1.G21
  Bottom 0.203: CC_IN.6 27.23,30.18 26.04,31.37 26.04,36.07 24.64,37.47 v17.83,37.47
G_CC3_N
  Bottom 0.15: CC_IN.12 35.91,29.54 35.94,29.57 43.75,29.57 44.17,29.15 44.17,25.85 46.17,23.85 47.83,23.85 48.77,24.79 CL_IN.16
G_CC3_P
  Bottom 0.15: CC_IN.11 35.63,30.18 35.94,29.87 43.88,29.87 44.47,29.27 44.47,25.97 45.65,24.79 CL_IN.3
G_CC4  (via drill 0.3)
  Top 0.203: v8.33,39.34 U$1.D20
  Bottom 0.203: CC_IN.7 27.46,30.84 26.67,31.62 26.67,36.32 24.89,38.1 9.47,38.12 v8.33,39.34
G_CC4_N
  Bottom 0.15: CC_IN.9 35.58,31.5 35.69,31.39 44.13,31.39 45.23,30.29 45.26,27.09 46.01,26.34 49.05,26.31 CL_IN.2
G_CC4_P
  Bottom 0.15: CC_IN.10 35.43,30.84 35.69,31.09 44.01,31.09 44.94,30.16 44.96,26.86 45.89,25.96 47.9,25.96 48.77,25.09 49.86,25.09 50.85,26.09 CL_IN.15
G_CLK  (via drill 0.3)
  Top 0.203: U$1.H4 v12.83,59.69 | v22.86,44.96 22.86,44.07 24.51,42.42 32.51,42.42 33.53,41.4 33.53,27.18 32.38,26.04 30.76,26.04 FRAMEGRABBER.26
  Bottom 0.203: v12.83,59.69 12.83,58.12 13.99,57.28 21.72,57.28 22.86,56.13 v22.86,44.96
G_D0
  Top 0.203: U$1.G22 10.79,36.2 21.21,36.2 22.1,35.31 22.1,32.64 23.37,31.37 31.75,31.37 32.77,30.35 32.77,27.43 31.88,26.54 30.76,26.54 FRAMEGRABBER.27
G_D1
  Top 0.203: U$1.H23 20.83,35.56 21.59,34.8 21.59,27.81 22.33,27.08 FRAMEGRABBER.29
G_D2
  Top 0.203: U$1.G24 10.79,33.66 20.32,33.66 21.21,32.77 21.21,27.3 21.95,26.57 FRAMEGRABBER.30
G_D3
  Top 0.203: U$1.H25 19.94,33.02 20.7,32.26 20.7,26.29 21.41,25.58 FRAMEGRABBER.32
G_D4
  Top 0.203: U$1.G25 10.79,32.38 19.56,32.38 20.32,31.62 20.32,25.65 20.9,25.07 FRAMEGRABBER.33
G_D5
  Top 0.203: U$1.H26 19.3,31.75 19.94,31.11 19.94,25.15 20.52,24.56 FRAMEGRABBER.34
G_D6
  Top 0.203: U$1.G27 10.79,29.84 18.92,29.84 19.56,29.21 19.56,24.77 20.24,24.08 FRAMEGRABBER.35
G_D7
  Top 0.203: U$1.H28 18.54,29.21 19.18,28.57 19.18,23.62 19.74,23.06 FRAMEGRABBER.37
G_D8
  Top 0.203: U$1.G28 10.79,28.57 18.29,28.57 18.8,28.07 18.8,23.24 19.46,22.58 FRAMEGRABBER.38
G_D9
  Top 0.203: U$1.H29 17.78,27.94 18.41,27.3 18.41,22.73 19.07,22.07 FRAMEGRABBER.39
G_D10
  Top 0.203: U$1.G30 10.79,26.04 17.14,26.04 17.91,25.27 17.91,21.72 18.54,21.08 FRAMEGRABBER.41
G_D11
  Top 0.203: U$1.H31 16.76,25.4 17.53,24.64 17.53,21.21 18.16,20.57 FRAMEGRABBER.42
G_D12
  Top 0.203: U$1.G31 10.79,24.77 16.13,24.77 17.14,23.75 17.14,20.7 17.78,20.07 FRAMEGRABBER.43
G_D13
  Top 0.203: U$1.H32 16,24.13 16.64,23.5 16.64,19.68 17.25,19.07 FRAMEGRABBER.45
G_D14
  Top 0.203: U$1.G33 10.79,22.23 15.37,22.23 16.2,21.36 16.2,19.07 16.74,18.57 FRAMEGRABBER.46
G_D15
  Top 0.203: U$1.H34 15.11,21.59 15.75,20.95 15.75,18.67 16.36,18.06 FRAMEGRABBER.47
G_D16
  Top 0.203: U$1.G34 10.79,20.95 14.61,20.95 15.24,20.32 15.24,18.21 15.82,17.63 21.13,17.63 21.72,17.07 FRAMEGRABBER.49 23.39,17.07
G_D17
  Top 0.203: U$1.H35 14.1,20.32 14.73,19.68 14.73,17.86 15.32,17.27 20.88,17.27 21.59,16.56 FRAMEGRABBER.50
G_D18
  Top 0.203: U$1.G36 10.79,18.41 13.59,18.41 14.22,17.78 14.22,17.42 14.78,16.87 20.7,16.87 21.51,16.08 FRAMEGRABBER.51
G_D19
  Top 0.203: U$1.H37 13.26,17.78 14.66,16.38 20.55,16.38 21.84,15.09 FRAMEGRABBER.53
G_D20
  Top 0.203: U$1.D26 7.75,31.75 8.56,30.91 8.56,13.64 8.89,13.34 12.39,13.34 13.64,14.58 FRAMEGRABBER.54
G_D21
  Top 0.203: U$1.D27 7.37,30.48 8.18,29.67 8.18,13.51 8.76,12.93 12.57,12.93 13.74,14.1 23.34,14.1 FRAMEGRABBER.55
G_D22
  Top 0.203: U$1.C22 3.56,36.83 2.41,35.69 2.41,6.1 5.84,2.67 25.91,2.67 28.32,5.08 28.32,12.7 29.21,13.59 30.71,13.59 FRAMEGRABBER.1
G_D23
  Top 0.203: U$1.D23 5.71,36.2 3.68,36.2 2.79,35.31 2.79,6.22 5.97,3.05 25.78,3.05 27.94,5.21 27.94,13.34 28.7,14.1 30.71,14.1 FRAMEGRABBER.2
G_D24
  Top 0.203: U$1.C23 4.19,35.56 3.17,34.54 3.17,6.48 6.1,3.56 25.65,3.56 27.56,5.46 27.56,13.84 28.32,14.61 30.71,14.61 FRAMEGRABBER.3
G_D25
  Top 0.203: U$1.D24 6.22,34.29 5.59,33.66 4.57,33.66 3.56,32.64 3.56,6.6 6.22,3.94 25.53,3.94 27.18,5.59 27.18,14.99 27.81,15.62 30.68,15.62 FRAMEGRABBER.5
G_D26
  Top 0.203: U$1.C26 4.57,31.75 3.94,31.11 3.94,6.73 6.38,4.29 25.27,4.29 26.8,5.84 26.8,15.37 27.56,16.13 30.68,16.13 FRAMEGRABBER.6
G_D27
  Top 0.203: U$1.C27 4.83,30.48 4.32,29.97 4.32,6.86 6.5,4.67 25.04,4.7 26.42,6.1 26.42,15.62 27.3,16.51 30.68,16.51 FRAMEGRABBER.7
G_SERFC  (via drill 0.3)
  Top 0.203: U$1.G37 10.19,17.78 10.82,17.14 13.21,17.14 14.53,15.82 v19.96,15.82
  Bottom 0.203: SER_IN.4 21.03,15.24 20.5,15.82 v19.96,15.82
G_SERFC_N
  Bottom 0.15: CL_IN.19 50.65,20.98 50.09,20.12 48.72,20.12 48.13,20.73 45.24,20.73 44.48,21.49 43.66,21.49 43.31,21.13 43.31,19.3 42.8,18.8 40.36,18.8 R6.2 40.16,18.8 38.73,18.8 38.48,18.54 38.48,18.03 38.12,17.68 37.15,17.68 36.81,17.33 36.81,16.83 36.39,16.41 35.43,16.41 35.3,16.54 SER_IN.9
G_SERFC_P  (via drill 0.3)
  Top 0.15: v44.12,22.5 v44.12,20.62
  Bottom 0.15: v44.12,20.62 44.12,16.26 43.56,15.75 40.36,15.75 R6.1 40.16,15.75 38.73,15.75 38.48,16 38.48,17.02 38.12,17.38 37.27,17.38 37.11,17.21 37.11,16.7 36.51,16.11 35.43,16.11 35.23,15.9 SER_IN.10 | v44.12,22.5 45.57,21.05 49.3,21.05 CL_IN.6
G_SERTC  (via drill 0.3)
  Top 0.203: v19.13,15.19 14.3,15.19 12.98,16.51 U$1.H38
  Bottom 0.203: SER_IN.2 20.47,13.95 v19.13,15.19
G_SERTC_N
  Bottom 0.15: SER_IN.11 35.33,15.24 35.69,14.88 38.03,14.88 39.3,13.61 44.26,13.61 45.19,14.54 45.14,19.42 45.73,19.99 47.16,19.99 CL_IN.7
G_SERTC_P
  Bottom 0.15: SER_IN.12 35.69,14.58 37.91,14.58 39.18,13.31 44.38,13.31 45.49,14.42 45.49,18.5 45.8,18.82 48.21,18.82 48.87,19.71 CL_IN.20
G_SHIELD
  Bottom 0.406: CL_IN.1 CL_IN.14 54.13,27.33 55.35,26.24 55.35,12.93 54.53,12.09 CL_IN.26 CL_IN.13
G_X0_N
  Top 0.15: FRAMEGRABBER.9 31.82,17.58 31.88,17.63 32.58,17.63 32.74,17.46 32.74,16.19 34.1,14.84 34.61,14.84 35.03,14.42 35.03,12.89 35.37,12.55 36.09,12.55 36.45,12.19 36.45,11.43 36.7,11.18 37.87,11.18 R10.2 38.48,11.28 39.75,12.55 43.12,12.55 43.52,12.96 48.21,12.96 48.87,12.34 49.99,12.34 51.26,13.36 CL_IN.25
G_X0_P
  Top 0.15: FRAMEGRABBER.10 31.75,18.06 31.88,17.93 32.7,17.93 33.04,17.59 33.04,16.32 34.23,15.14 34.73,15.14 35.33,14.54 35.33,13.02 35.49,12.85 36.09,12.85 36.45,13.21 36.45,13.72 36.7,13.97 37.82,13.97 R10.1 38.48,14.12 39.75,12.85 42.99,12.85 43.5,13.36 CL_IN.12
G_X1_N
  Top 0.15: FRAMEGRABBER.11 32.05,18.57 32.13,18.65 32.83,18.65 33.51,17.97 33.51,16.45 34.35,15.6 39.9,15.6 40.26,15.24 40.26,14.73 40.51,14.48 42.44,14.48 R9.2 42.29,14.58 43.56,15.85 44.01,15.85 45.02,14.84 46.25,14.84 46.99,13.77 48.01,13.77 48.84,14.61 CL_IN.24
G_X1_P
  Top 0.15: FRAMEGRABBER.12 32,19.07 32.13,18.95 32.95,18.95 33.8,18.1 33.8,16.57 34.48,15.9 39.9,15.9 40.26,16.26 40.26,17.27 40.51,17.53 42.44,17.53 R9.1 42.29,17.42 43.56,16.15 44.13,16.15 45.15,15.14 47.14,15.14 CL_IN.11
G_X2_N
  Top 0.15: FRAMEGRABBER.15 32.03,20.57 32.13,20.68 33.09,20.68 33.51,20.26 33.51,19.5 34.1,18.9 35.08,18.9 35.43,18.54 35.43,17.78 35.69,17.53 36.85,17.53 R8.2 37.46,17.63 38.99,19.15 44.26,19.15 44.43,18.99 44.45,16.55 45.43,15.55 48.18,15.52 48.67,15.04 50.19,15.04 51.08,15.9 CL_IN.23
G_X2_P
  Top 0.15: FRAMEGRABBER.16 32.03,21.08 32.13,20.98 33.21,20.98 33.8,20.38 33.8,19.62 34.23,19.2 35.08,19.2 35.43,19.56 35.43,20.32 35.69,20.57 36.85,20.57 R8.1 38.02,20.47 38.96,19.5 44.49,19.5 44.83,19.16 44.83,16.7 45.65,15.9 CL_IN.10
G_X3_N
  Top 0.15: FRAMEGRABBER.19 32,22.58 32.13,22.71 33.21,22.71 34.63,24.13 37.87,24.13 R7.2 38.23,24.23 39.37,25.1 43.65,25.07 45.98,22.75 45.98,19.55 47.36,18.14 48.11,18.14 48.64,17.6 50.04,17.58 50.88,18.44 CL_IN.21
G_X3_P
  Top 0.15: FRAMEGRABBER.20 32.08,23.06 32.13,23.01 33.09,23.01 37.15,27.08 R7.1 | 37.87,27.18 R7.1 | R7.1 38.73,27.08 40.41,25.42 43.75,25.4 46.35,22.82 46.33,19.67 47.53,18.44 CL_IN.8
G_XCLK_N
  Top 0.15: FRAMEGRABBER.17 32,21.57 32.13,21.69 34.23,21.69 34.73,22.2 39.39,22.2 39.75,21.84 39.75,21.08 40.01,20.83 42.44,20.83 | 42.44,20.83 R11.2 | 42.44,20.83 42.8,20.83 43.81,19.81 44.94,19.81 45.19,19.56 45.19,16.98 45.99,16.2 48.08,16.2 48.77,17.17 CL_IN.22
G_XCLK_P
  Top 0.15: FRAMEGRABBER.18 32.05,22.07 32.13,21.99 34.1,21.99 34.61,22.5 39.39,22.5 39.75,22.86 39.75,23.62 40.01,23.88 42.44,23.88 | 42.44,23.88 R11.1 | 42.44,23.88 44.32,23.88 45.59,22.61 45.59,19.66 45.49,19.56 45.49,17.84 45.94,17.17 46.91,17.17 CL_IN.9
GND  (via drill 0.3)
  Top 0.203: 5.59,34.92 6.99,34.92 | U$1.H6 v12.98,57.15 | U$1.H9 v15.16,53.34 | U$1.H12 v16.15,49.53 | U$1.H15 v17.91,45.72 | U$1.H18 v16.2,41.88 | U$1.G5 10.16,59.72 11.4,60.94 12.83,60.94 v13.31,60.58 | 9.02,32.03 9.88,32.03 U$1.G26 U$1.H27 | 10.06,28.04 U$1.G29 U$1.H30 16.82,26.67 v17.17,27.03 | 9.02,24.43 9.86,24.43 U$1.G32 U$1.H33 | U$1.H36 11.71,19.33 v13.79,19.33 | 6.35,29.34 5.8,29.88 5.63,29.88 | U$1.C40 5.08,10.24 v7.64,7.67 | 7.62,12.24 8.41,11.35 v8.56,11.35 | U$1.D37 6.33,17.8 6.3,17.8 | 5.08,19.02 U$1.C36 | U$1.H24 11.81,34.67 v17.86,34.67 | U$1.H24 U$1.G23 9.02,34.42 | U$1.H24 11.48,34.29 | U$1.D19 6.33,40.64 | 5.11,39.42 2.62,39.42 2.46,39.57 | U$1.G14 8.89,46.99 U$1.D16
  Top 0.254: U$1.C28 U$1.C29 | U$1.C32 U$1.C33 U$1.C34 U$1.D35 | U$1.G40 U$1.H39 U$1.G38 9.02,17.65 9.02,24.43 9.02,32.03 9.02,34.42 | 10.24,50.8 10.87,51.44 v15.67,51.44 | U$1.G8 10.21,54.61 10.82,55.22 14.22,55.22 v14.28,55.27 | U$1.D39 7.62,14.12 | 7.62,14.12 7.62,12.24 | U$1.C38 U$1.D37 | 6.3,17.8 5.08,19.02 | U$1.D35 7.62,19.05 7.62,14.12 | U$1.C36 U$1.D35 | 6.33,40.64 5.11,39.42 | U$1.G17 7.62,40.64 | 7.62,40.64 U$1.D19 | U$1.H21 8.89,40.64 7.62,40.64
  Top 0.305: U$1.C1 U$1.D2 U$1.D3 U$1.C4 U$1.C5 U$1.D6 U$1.D7 U$1.C8 U$1.C9 U$1.D10 6.35,51.94 5.71,51.31 5.71,50.16 U$1.C12 U$1.C13 | U$1.C13 U$1.D13 | U$1.D16 U$1.C16 | U$1.C13 5.21,48.26 5.71,47.75 5.71,45.09 U$1.C16 | U$1.C16 U$1.C17 5.71,42.55 5.71,41.27 U$1.D19 | U$1.C24 5.08,34.42 5.59,34.92 | 6.99,34.92 7.11,35.05 | 7.11,35.05 7.49,35.43 7.49,35.69 | 7.49,35.69 7.49,36.32 7.11,36.7 6.48,36.7 U$1.D22 U$1.C21 U$1.C20 | U$1.D25 7.11,33.02 7.75,33.66 7.75,34.42 7.11,35.05 | U$1.C25 U$1.D25 | U$1.D28 6.35,29.34 | U$1.D25 5.71,32.38 5.71,29.97 5.63,29.88 5.08,29.34 U$1.C28 | U$1.H36 U$1.G35 | U$1.H21 U$1.G20 | U$1.G5 U$1.G4 11.4,60.94 U$1.H3 11.43,61.09 10.79,61.72 10.79,62.87 U$1.G1 | U$1.G23 7.62,35.56 7.49,35.69
  Top 0.406: U$1.G11 10.24,50.8
  other vias: 2.01,40.13 2.08,37.39 20.42,10.21 26.42,17.4 27.94,18.8 25.2,19.56 24.99,16.18 27.66,23.19 27.69,21.77 22.73,29.72 30.61,30.23 31.88,28.32 30.86,37.08 28.83,37.08 27.94,32.77 24.64,33.66 22.99,33.66 28.83,40.39 30.86,40.39 30.86,44.07 29.84,46.61 28.57,44.07 27.81,46.61 21.46,45.97 21.46,50.16 21.46,53.34 25.78,54.1 26.16,50.8 25.53,55.75 20.95,55.75 25.65,60.2 28.57,70.48 25.27,68.33 43.69,71.12 37.85,73.53 43.56,76.2 37.85,78.49 30.1,78.36 22.73,78.36 16.51,78.36 9.4,78.36 3.3,76.2 17.04,69.52 21.26,72.77 1.96,38.84 40.34,39.24 17.93,30.81 20.4,11.33 25.17,23.88 21.44,11.3 21.41,10.21 2.16,2.54 10.67,1.4 17.14,1.4 23.24,1.4 30.35,2.29 38.48,2.29 34.54,6.35 42.42,6.35 53.98,8.26 53.47,32.77 40.31,38.38 41.17,39.24 40.34,40.06 41.17,38.35 43.05,45.47 41.17,40.08 52.32,48.01 35.05,59.31 52.96,72.01 52.96,77.72 17.2,13.44 26.16,64.26 29.59,62.1 33.53,25.02 38.73,21.21 43.31,22.99 43.56,17.91 41.15,67.18 38.25,64.57 40.13,64.57
  pour Bottom: 0.13,79.88 56.64,79.88 56.64,0.13 0.13,0.13
  pour Top: 0.13,79.88 56.77,79.88 56.77,0.13 0.13,0.13
VCC  (via drill 0.3)
  Top 0.15: 23.98,57.66 FRAMEPUSHER.26 | U$1.D38 6.6,16.51 | FRAMEGRABBER.56 24.66,13.56 | 23.42,17.53 FRAMEGRABBER.48 | 23.47,26.16 FRAMEGRABBER.31
  Top 0.203: 23.93,66.29 FRAMEPUSHER.9 | C1.1 27.05,71.43
  Top 0.254: 6.99,9.73 15.88,9.73 15.97,9.68 C4.1
  Top 0.305: v33.73,64.01 32.64,64.01 32.38,64.26 FRAMEPUSHER.44 29.59,64.26 | FRAMEPUSHER.34 30.28,59.26 | FRAMEPUSHER.32 30.02,58.24 29.84,58.42 | 29.84,58.42 29.84,58.83 30.28,59.26 | 29.84,58.42 29.59,58.17 29.34,58.17 v28.57,57.4 27.81,57.4 26.92,58.29 | 24.66,13.56 v25.32,13.18 | 24.77,17.53 23.42,17.53 | C2.1 25.91,27.3 24.66,26.06 FRAMEGRABBER.31 24.74,26.06 25.91,24.89 | FRAMEGRABBER.25 28.83,25.58 28.14,24.89 v27.89,24.89 | FRAMEGRABBER.23 28.91,24.56 v27.89,24.89 | FRAMEPUSHER.1 25.88,70.26 | 25.88,70.26 26.04,70.1 26.04,66.55 | 26.04,66.55 25.78,66.29 23.93,66.29 | 27.05,71.43 25.88,70.26 | FRAMEPUSHER.17 26.52,62.26 26.92,61.85 26.92,58.29 | 6.99,9.73 6.35,10.54 U$1.D40 U$1.C39 U$1.D38 7.11,17.27 7.11,18.29 U$1.D36 | 15.88,9.73 15.88,10.92 18.52,13.56 FRAMEGRABBER.56 24.61,13.56 25.78,14.33 25.78,16.92 24.77,17.53 | 25.91,24.89 25.91,22.73 24.77,21.59 23.39,21.59 FRAMEGRABBER.40 24.79,21.57 25.91,20.45 | 25.91,20.45 25.91,18.67 24.77,17.53 | 25.91,20.45 28.07,20.45 28.96,19.56 FRAMEGRABBER.13 | 26.92,58.29 26.8,58.29 26.29,57.78 23.9,57.78 FRAMEPUSHER.26 | 26.04,66.55 27.3,66.55 29.59,64.26 | 25.91,24.89 v27.89,24.89 | 29.59,64.26 28.57,63.25 28.57,60.96 30.28,59.26
  Bottom 0.15: 28.6,51.05 CC_OUT.13 | 28.6,28.96 CC_IN.4 | 34.16,65.3 SER_OUT.14 | C5.1 29.97,56.01 | C6.1 29.97,10.8 | 28.57,13.23 SER_IN.1 28.45,13.21
  Bottom 0.305: C5.1 29.97,54.53 CC_OUT.16 29.59,53.09 29.84,52.83 29.84,51.31 | 29.84,51.31 29.59,51.05 28.6,51.05 | SER_IN.1 SER_IN.14 | 30.86,28.96 31.88,29.97 31.88,32 32.77,32.9 C7.1 32.77,45.34 32.38,45.72 32.38,48.77 29.84,51.31 | 30.86,28.96 28.6,28.96 | SER_OUT.14 33.15,65.35 | 33.15,65.35 SER_OUT.1 | C3.1 32.77,65.73 33.15,65.35 | v33.73,64.01 33.66,64.01 34.16,64.52 34.16,65.3 | 29.97,56.01 v28.57,57.4 | 29.97,10.8 28.57,12.19 28.57,13.23 | v25.32,13.18 28.45,13.21 | v27.89,24.89 28.5,25.43 CC_IN.1 29.97,26.92 30.86,27.81 30.86,28.96